# Altium schematic sheet OutputChannel.SchDoc: Output Channel
size A4
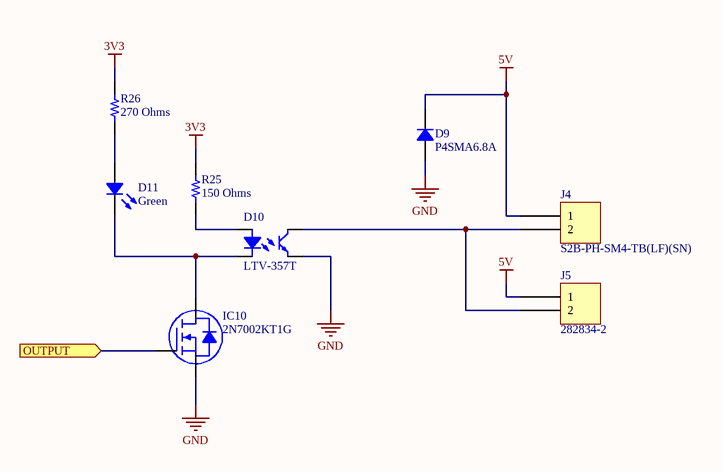
[diagram p0: OutputChannel.SchDoc]

## Parts
D9  P4SMA6.8A  [DO214AC SMA]
D10  LTV-357T  [LITEON LTV-357T]
D11  Green  [LED 0603_1608 GREEN]
IC10  2N7002KT1G  [ON SEMI SOT-23-3]
J4  S2B-PH-SM4-TB(LF)(SN)  [JST S2B-PH-SM4-TB]
J5  282834-2  [TE 282834-2]
R25  150 Ohms  [RES 0603_1608]
R26  270 Ohms  [RES 0603_1608]

## Ports
OUTPUT (in)

## Nets
3V3: R25.2 R26.2
5V: D9.2 J4.1 J5.1
GND: D9.1 D10.3 IC10.2(S)
OUTPUT: IC10.1(G) ; port OUTPUT
NetD10_1: D10.1 R25.1
NetD10_2: D10.2 D11.2 IC10.3(D)
NetD10_4: D10.4 J4.2 J5.2
NetD11_1: D11.1 R26.1

## Notes on the sheet
- Title
- Size:
- Date:
- A4
- Number:
- Time:
- Revision:
- Sheet
- of
- File:

## Library data of the parts
D9 = P4SMA6.8A: TVS DIODE 5.8V 10.5V DO214AC; Manufacturer: Littelfuse Inc.; Current - Peak Pulse (10/1000µs): 39A; Power Line Protection: No; Power - Peak Pulse: 400W; Type: Zener; Unidirectional Channels: 1; Voltage - Breakdown (Min): 6.45V; Part Number: P4SMA6.8A; Applications: General Purpose; ComponentLink1Description: Datasheet; ComponentLink1URL: https://www.littelfuse.com/~/media/electronics/datasheets/tvs_diodes/littelfuse_tvs_diode_p4sma_datasheet.pdf.pdf; ComponentLink2Description: DigiKey Link; ComponentLink2URL: http://digikey.com/product-detail/en/littelfuse-inc/P4SMA6.8A/F5656CT-ND/3307038; Device Package: DO-214AC, SMA; LastUpdated: 21/01/2020 03:10:24; Lifecycle Status: Active; Minimum Order: 1; Mounting Type: Surface Mount; Operating Temperature: -65°C ~ 150°C (TJ); Package / Case: DO-214AC, SMA; Packaging: TapeAndReel; PartId: 395; Part Status: Active; Price: 0.13; Series: P4SMA; Supplier 1: DigiKey; Supplier Part Number 1: F5656CT-ND; Supplier Device Package: DO-214AC (SMA); Voltage - Clamping (Max) @ Ipp: 10.5V; Voltage - Reverse Standoff (Typ): 5.8V
D10 = LTV-357T: OPTOISOLATOR 3.75KV TRANS 4-SOP; Manufacturer: Lite-On Inc.; Current - DC Forward (If) (Max): 50mA; Current Transfer Ratio (Max): 600% @ 5mA; Current Transfer Ratio (Min): 50% @ 5mA; Input Type: DC; Number of Channels: 1; Output Type: Transistor; Rise / Fall Time (Typ): 4µs, 3µs; Vce Saturation (Max): 200mV; Voltage - Forward (Vf) (Typ): 1.2V; Voltage - Isolation: 3750Vrms; Voltage - Output (Max): 35V; Part Number: LTV-357T; ComponentLink1Description: Datasheet; ComponentLink1URL: http://optoelectronics.liteon.com/upload/download/DS70-2001-012/LTV-357T%20series%20201606.pdf; ComponentLink2Description: DigiKey Link; ComponentLink2URL: http://digikey.com/product-detail/en/lite-on-inc/LTV-357T/160-1339-1-ND/385809; Current - Output / Channel: 50mA; Device Package: 4-SMD, Gull Wing; LastUpdated: 12/01/2020 21:57:43; Lifecycle Status: Active; Minimum Order: 1; Mounting Type: Surface Mount; Operating Temperature: -55°C ~ 110°C; Package / Case: 4-SMD, Gull Wing; Packaging: TapeAndReel; Part Status: Active; Price: 0.12; Series: -; Supplier 1: DigiKey; Supplier Part Number 1: 160-1339-1-ND; Supplier Device Package: 4-SOP
D11 = LTST-C190KGKT: LED GREEN CLEAR CHIP SMD; Manufacturer: Lite-On Inc.; Configuration: Standard; Current - Test: 20mA; Lens Color: Colorless; Lens Size: 1.10mm x 0.80mm; Lens Style: Rectangle with Flat Top; Millicandela Rating: 35mcd; Viewing Angle: 130°; Voltage - Forward (Vf) (Typ): 2V; Wavelength - Dominant: 571nm; Wavelength - Peak: 574nm; Part Number: LTST-C190KGKT; Color: Green; ComponentLink1Description: Datasheet; ComponentLink1URL: http://optoelectronics.liteon.com/upload/download/DS22-2000-074/LTST-C190KGKT.PDF; ComponentLink2Description: DigiKey Link; ComponentLink2URL: http://digikey.com/product-detail/en/lite-on-inc/LTST-C190KGKT/160-1435-1-ND/386814; Device Package: 0603 (1608 Metric); Height (Max): 0.90mm; LastUpdated: 21/01/2020 03:12:09; Lens Transparency: Clear; Lifecycle Status: Active; Minimum Order: 1; Mounting Type: Surface Mount; Package / Case: 0603 (1608 Metric); Packaging: TapeAndReel; PartId: 657; Part Status: Active; Price: 0.04; Series: -; Size / Dimension: 1.60mm L x 0.80mm W; Supplier 1: DigiKey; Supplier Part Number 1: 160-1435-1-ND; Supplier Device Package: Chip LED; Value: Green
IC10 = 2N7002KT1G: MOSFET N-CH 60V 320MA SOT-23; Manufacturer: ON Semiconductor; Current - Continuous Drain (Id) @ 25°C: 320mA (Ta); Drive Voltage (Max Rds On,  Min Rds On): 4.5V, 10V; FET Type: N-Channel; Gate Charge (Qg) (Max) @ Vgs: 0.7nC @ 4.5V; Input Capacitance (Ciss) (Max) @ Vds: 24.5pF @ 20V; Power Dissipation (Max): 350mW (Ta); Rds On (Max) @ Id, Vgs: 1.6Ohm @ 500mA, 10V; Vgs (Max): ±20V; Vgs(th) (Max) @ Id: 2.5V @ 250µA; Part Number: 2N7002KT1G; ComponentLink1Description: Datasheet; ComponentLink1URL: http://www.onsemi.com/pub/Collateral/2N7002K-D.PDF; ComponentLink2Description: DigiKey Link; ComponentLink2URL: http://digikey.com/product-detail/en/on-semiconductor/2N7002KT1G/2N7002KT1GOSCT-ND/1967030; Device Package: TO-236-3, SC-59, SOT-23-3; Drain to Source Voltage (Vdss): 60V; LastUpdated: 21/01/2020 04:01:12; Lifecycle Status: Active; Minimum Order: 1; Mounting Type: Surface Mount; Operating Temperature: -55°C ~ 150°C (TJ); Package / Case: TO-236-3, SC-59, SOT-23-3; Packaging: TapeAndReel; Part Status: Active; Price: 0.03; Series: -; Supplier 1: DigiKey; Supplier Part Number 1: 2N7002KT1GOSCT-ND; Supplier Device Package: SOT-23-3 (TO-236); Technology: MOSFET (Metal Oxide)
J4 = S2B-PH-SM4-TB(LF)(SN): CONN HEADER SMD R/A 2POS 2MM; Manufacturer: JST Sales America Inc.; Contact Length - Mating: 0.130" (3.30mm); Current Rating (Amps): 2A; Material Flammability Rating: UL94 V-0; Number of Positions: 2; Number of Positions Loaded: All; Pitch - Mating: 0.079" (2.00mm); Shrouding: Shrouded - 4 Wall; Style: Board to Cable/Wire; Voltage Rating: 100V; Part Number: S2B-PH-SM4-TB(LF)(SN); ComponentLink1Description: Datasheet; ComponentLink1URL: http://www.jst-mfg.com/product/pdf/eng/ePH.pdf; ComponentLink2Description: DigiKey Link; ComponentLink2URL: http://digikey.com/product-detail/en/jst-sales-america-inc/S2B-PH-SM4-TB-LF-SN/455-1749-1-ND/926846; Connector Type: Header; Contact Finish - Mating: Tin; Contact Finish - Post: Tin; Contact Material: Copper Alloy; Contact Shape: Square; Contact Type: Male Pin; Fastening Type: Detent Lock; Features: Solder Retention; Insulation Color: Natural; Insulation Height: 0.217" (5.51mm); Insulation Material: Polyamide (PA6T), Nylon 6T; LastUpdated: 15/01/2020 03:45:11; Lifecycle Status: Active; Minimum Order: 1; Mounting Type: Surface Mount, Right Angle; Number of Rows: 1; Operating Temperature: -25°C ~ 85°C; Packaging: TapeAndReel; PartId: 115; Part Status: Active; Price: 0.27; Series: PH; Supplier 1: DigiKey; Supplier Part Number 1: 455-1749-1-ND; Termination: Solder
J5 = 282834-2: TERM BLK 2P SIDE ENT 2.54MM PCB; Manufacturer: TE Connectivity AMP Connectors; Current: 10A; Mating Orientation: Horizontal with Board; Number of Levels: 1; Pitch: 0.100" (2.54mm); Positions Per Level: 2; Voltage: 150V; Wire Gauge: 16-30 AWG; Wire Termination: Screw - Rising Cage Clamp; Part Number: 282834-2; Color: Green; ComponentLink1Description: Datasheet; ComponentLink1URL: https://www.te.com/commerce/DocumentDelivery/DDEController?Action=srchrtrv&DocNm=282834&DocType=Customer+Drawing&DocLang=English; ComponentLink2Description: DigiKey Link; ComponentLink2URL: http://digikey.com/product-detail/en/te-connectivity-amp-connectors/282834-2/A98333-ND/1150135; LastUpdated: 15/01/2020 04:15:38; Lifecycle Status: Active; Minimum Order: 1; Mounting Type: Through Hole; Packaging: Bulk; Part Status: Active; Price: 0.88; Series: Buchanan; Supplier 1: DigiKey; Supplier Part Number 1: A98333-ND
R25 = ERJ-3EKF1500V: RES SMD 150 OHM 1% 1/10W 0603; Manufacturer: Panasonic Electronic Components; Power (Watts): 0.1W, 1/10W; Temperature Coefficient: ±100ppm/°C; Part Number: ERJ-3EKF1500V; Value: 150 Ohms; ComponentLink1Description: Datasheet; ComponentLink1URL: https://industrial.panasonic.com/cdbs/www-data/pdf/RDA0000/AOA0000C304.pdf; ComponentLink2Description: DigiKey Link; ComponentLink2URL: http://digikey.com/product-detail/en/panasonic-electronic-components/ERJ-3EKF1500V/P150HCT-ND/198177; Composition: Thick Film; Device Package: 0603 (1608 Metric); Features: Automotive AEC-Q200; Height - Seated (Max): 0.022" (0.55mm); LastUpdated: 21/01/2020 00:17:12; Lifecycle Status: Active; Minimum Order: 1; Number of Terminations: 2; Operating Temperature: -55°C ~ 155°C; Package / Case: 0603 (1608 Metric); Packaging: TapeAndReel; PartId: 23070; Part Status: Active; Price: 0.01; Ratings: AEC-Q200; Resistance: 150 Ohms; Series: ERJ; Size / Dimension: 0.063" L x 0.031" W (1.60mm x 0.80mm); Supplier 1: DigiKey; Supplier Part Number 1: P150HCT-ND; Supplier Device Package: 0603; Tolerance: ±1%
R26 = ERJ-3EKF2700V: RES SMD 270 OHM 1% 1/10W 0603; Manufacturer: Panasonic Electronic Components; Power (Watts): 0.1W, 1/10W; Temperature Coefficient: ±100ppm/°C; Part Number: ERJ-3EKF2700V; Value: 270 Ohms; ComponentLink1Description: Datasheet; ComponentLink1URL: https://industrial.panasonic.com/cdbs/www-data/pdf/RDA0000/AOA0000C304.pdf; ComponentLink2Description: DigiKey Link; ComponentLink2URL: http://digikey.com/product-detail/en/panasonic-electronic-components/ERJ-3EKF2700V/P270HCT-ND/1746751; Composition: Thick Film; Device Package: 0603 (1608 Metric); Features: Automotive AEC-Q200; Height - Seated (Max): 0.022" (0.55mm); LastUpdated: 21/01/2020 00:17:12; Lifecycle Status: Active; Minimum Order: 1; Number of Terminations: 2; Operating Temperature: -55°C ~ 155°C; Package / Case: 0603 (1608 Metric); Packaging: TapeAndReel; PartId: 23153; Part Status: Active; Price: 0.01; Ratings: AEC-Q200; Resistance: 270 Ohms; Series: ERJ; Size / Dimension: 0.063" L x 0.031" W (1.60mm x 0.80mm); Supplier 1: DigiKey; Supplier Part Number 1: P270HCT-ND; Supplier Device Package: 0603; Tolerance: ±1%